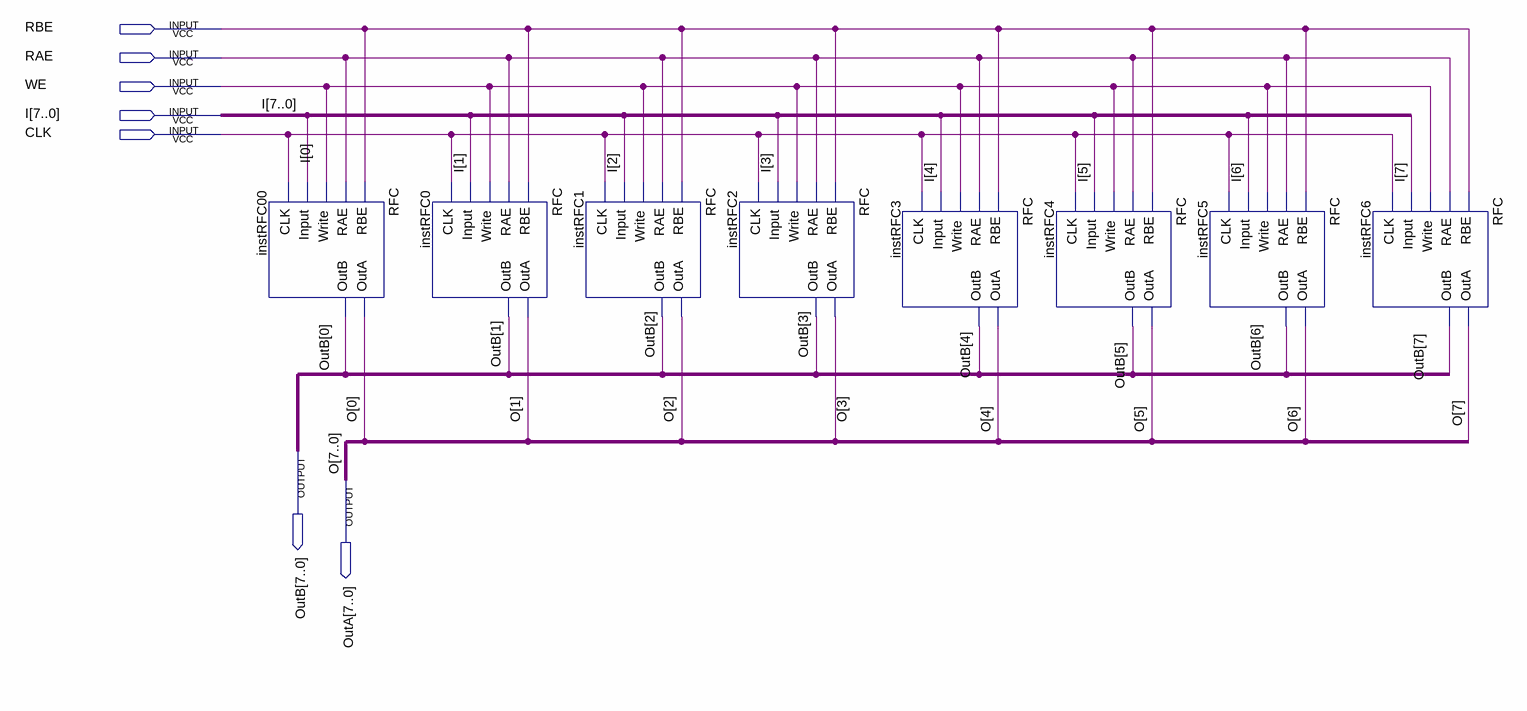
[diagram p0: schematic sheet]
// Quartus schematic Register.bdf as structural Verilog: 8 symbols, 7 pins
module Register (
  input  RBE,
  input  RAE,
  input  WE,
  input  [7:0] I,
  input  CLK,
  output [7:0] OutB,
  output [7:0] OutA
);

  RFC instRFC00 (.RBE(RBE), .RAE(RAE), .Write(WE), .Input(I[0]), .CLK(CLK), .OutA(OutA[0]), .OutB(OutB[0]));
  RFC instRFC0 (.RBE(RBE), .RAE(RAE), .Write(WE), .Input(I[1]), .CLK(CLK), .OutA(OutA[1]), .OutB(OutB[1]));
  RFC instRFC1 (.RBE(RBE), .RAE(RAE), .Write(WE), .Input(I[2]), .CLK(CLK), .OutA(OutA[2]), .OutB(OutB[2]));
  RFC instRFC2 (.RBE(RBE), .RAE(RAE), .Write(WE), .Input(I[3]), .CLK(CLK), .OutA(OutA[3]), .OutB(OutB[3]));
  RFC instRFC3 (.RBE(RBE), .RAE(RAE), .Write(WE), .Input(I[4]), .CLK(CLK), .OutA(OutA[4]), .OutB(OutB[4]));
  RFC instRFC4 (.RBE(RBE), .RAE(RAE), .Write(WE), .Input(I[5]), .CLK(CLK), .OutA(OutA[5]), .OutB(OutB[5]));
  RFC instRFC5 (.RBE(RBE), .RAE(RAE), .Write(WE), .Input(I[6]), .CLK(CLK), .OutA(OutA[6]), .OutB(OutB[6]));
  RFC instRFC6 (.RBE(RBE), .RAE(RAE), .Write(WE), .Input(I[7]), .CLK(CLK), .OutA(OutA[7]), .OutB(OutB[7]));

  // Other names for the same wires on the sheet: O[7:0] = OutA
endmodule
